# Altium project Logic_SOM.PrjPcb
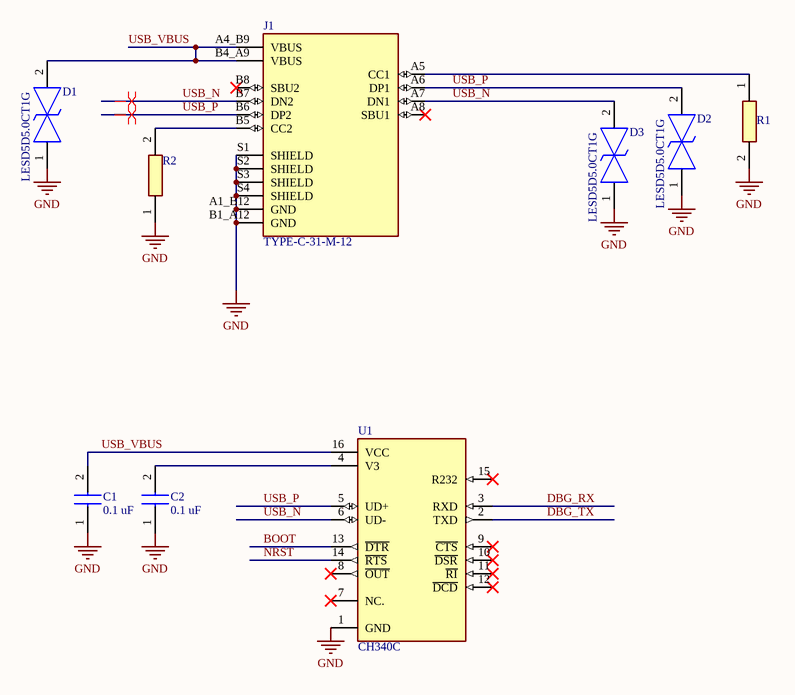
[diagram p0: programmer.SchDoc]
5 sheets, 61 parts. Net scope: global (net labels, ports and power ports of the same name join across sheets).
Board file: PCB1.PcbDoc
Sheets:
  programmer.SchDoc
  MCU.SchDoc
  PWR.SchDoc
  GSM.SchDoc
  ADC.SchDoc

## Sheet programmer.SchDoc
size A; SheetNumber: 1; SheetTotal: 5

### Parts
C1  0.1 uF  [CAP0603]
C2  0.1 uF  [CAP0603]
D1  LESD5D5.0CT1G  [LESD5D50CT1G]
D2  LESD5D5.0CT1G  [LESD5D50CT1G]
D3  LESD5D5.0CT1G  [LESD5D50CT1G]
J1  TYPE-C-31-M-12  [HRO_TYPE-C-31-M-12]
R1  CRCW0402100KFKEDHP  [RESC1005X40N]  (value not drawn)
R2  CRCW0402100KFKEDHP  [RESC1005X40N]  (value not drawn)
U1  CH340C  [SOIC127P600X180-16N]

### Nets
GND: C1.1 C2.1 D1.1 D2.1 D3.1 J1.A1_B12(GND) J1.B1_A12(GND) J1.S1(SHIELD) J1.S2(SHIELD) J1.S3(SHIELD) J1.S4(SHIELD) R1.2 R2.1 U1.1(GND)
USB_VBUS: C1.2 D1.2 J1.A4_B9(VBUS) J1.B4_A9(VBUS) U1.16(VCC)
BOOT: U1.13(~{DTR})
DBG_RX: U1.3(RXD)
DBG_TX: U1.2(TXD)
NRST: U1.14(~{RTS})
USB_N: D3.2 J1.A7(DN1) J1.B7(DN2) U1.6(UD-)
USB_P: D2.2 J1.A6(DP1) J1.B6(DP2) U1.5(UD+)
NetC2_2: C2.2 U1.4(V3)
NetJ1_A5: J1.A5(CC1) R1.1
NetJ1_B5: J1.B5(CC2) R2.2

Not connected (* = marked no-connect by the designer): J1 A8(SBU1)* B8(SBU2)*; U1 7(NC.)* 8(~{OUT})* 9(~{CTS})* 10(~{DSR})* 11(~{RI})* 12(~{DCD})* 15(R232)*

### Layout directives
differential pair: USB_N, USB_P

### Library data of the parts
C1 C2 = CC0603KRX7R9BB104: Capacitor; Manufacturer_Name: YAGEO; Datasheet Link: https://componentsearchengine.com/Datasheets/2/CC0603KRX7R9BB104.pdf; Height: 0.9mm; Manufacturer_Part_Number: CC0603KRX7R9BB104; Mouser Part Number: 603-CC603KRX7R9BB104; Mouser Price/Stock: https://www.mouser.co.uk/ProductDetail/YAGEO/CC0603KRX7R9BB104?qs=vTakOoo5QyLvVCYM2ge8LQ%3D%3D; Arrow Part Number: CC0603KRX7R9BB104; Arrow Price/Stock: https://www.arrow.com/en/products/cc0603krx7r9bb104/yageo?utm_currency=USD&region=europe
D1-D3 = LESD5D5.0CT1G: TVS Diode (Bi-directional); Manufacturer_Name: LRC; Height: 0.7mm; Manufacturer_Part_Number: LESD5D5.0CT1G
J1 = TYPE-C-31-M-12: USB Connectors 24 Receptacle 1 8.94*7.3mm RoHS; MF: HRO Electronics Co., Ltd.; SnapEDA_Link: https://www.snapeda.com/parts/TYPE-C-31-M-12/HRO+Electronics+Co.%252C+Ltd./view-part/?ref=snap; Package: Package; Value: *; MP: TYPE-C-31-M-12; Check_prices: https://www.snapeda.com/parts/TYPE-C-31-M-12/HRO+Electronics+Co.%252C+Ltd./view-part/?ref=eda
R1 R2 = CRCW0402100KFKEDHP: Resistor; Manufacturer_Name: Vishay; Datasheet Link: http://www.vishay.com/docs/20035/dcrcwe3.pdf; Height: 0.4mm; Manufacturer_Part_Number: CRCW0402100KFKEDHP; Mouser Part Number: 71-CRCW0402100KFKEDH; Mouser Price/Stock: https://www.mouser.co.uk/ProductDetail/Vishay-Dale/CRCW0402100KFKEDHP?qs=k2%2FDWSARqgGFakjlJe4Ejw%3D%3D; Arrow Part Number: CRCW0402100KFKEDHP; Arrow Price/Stock: https://www.arrow.com/en/products/crcw0402100kfkedhp/vishay?utm_currency=USD&region=nac
U1 = CH340C: USB to serial chip CH340; MF: WCH; Price: None; Availability: Not in stock; MP: CH340C; Package: None; SnapEDA_Link: https://www.snapeda.com/parts/CH340C/WCH/view-part/?ref=snap; Check_prices: https://www.snapeda.com/parts/CH340C/WCH/view-part/?ref=eda; Value: *

## Sheet MCU.SchDoc
size A3; SheetNumber: 2; SheetTotal: 5
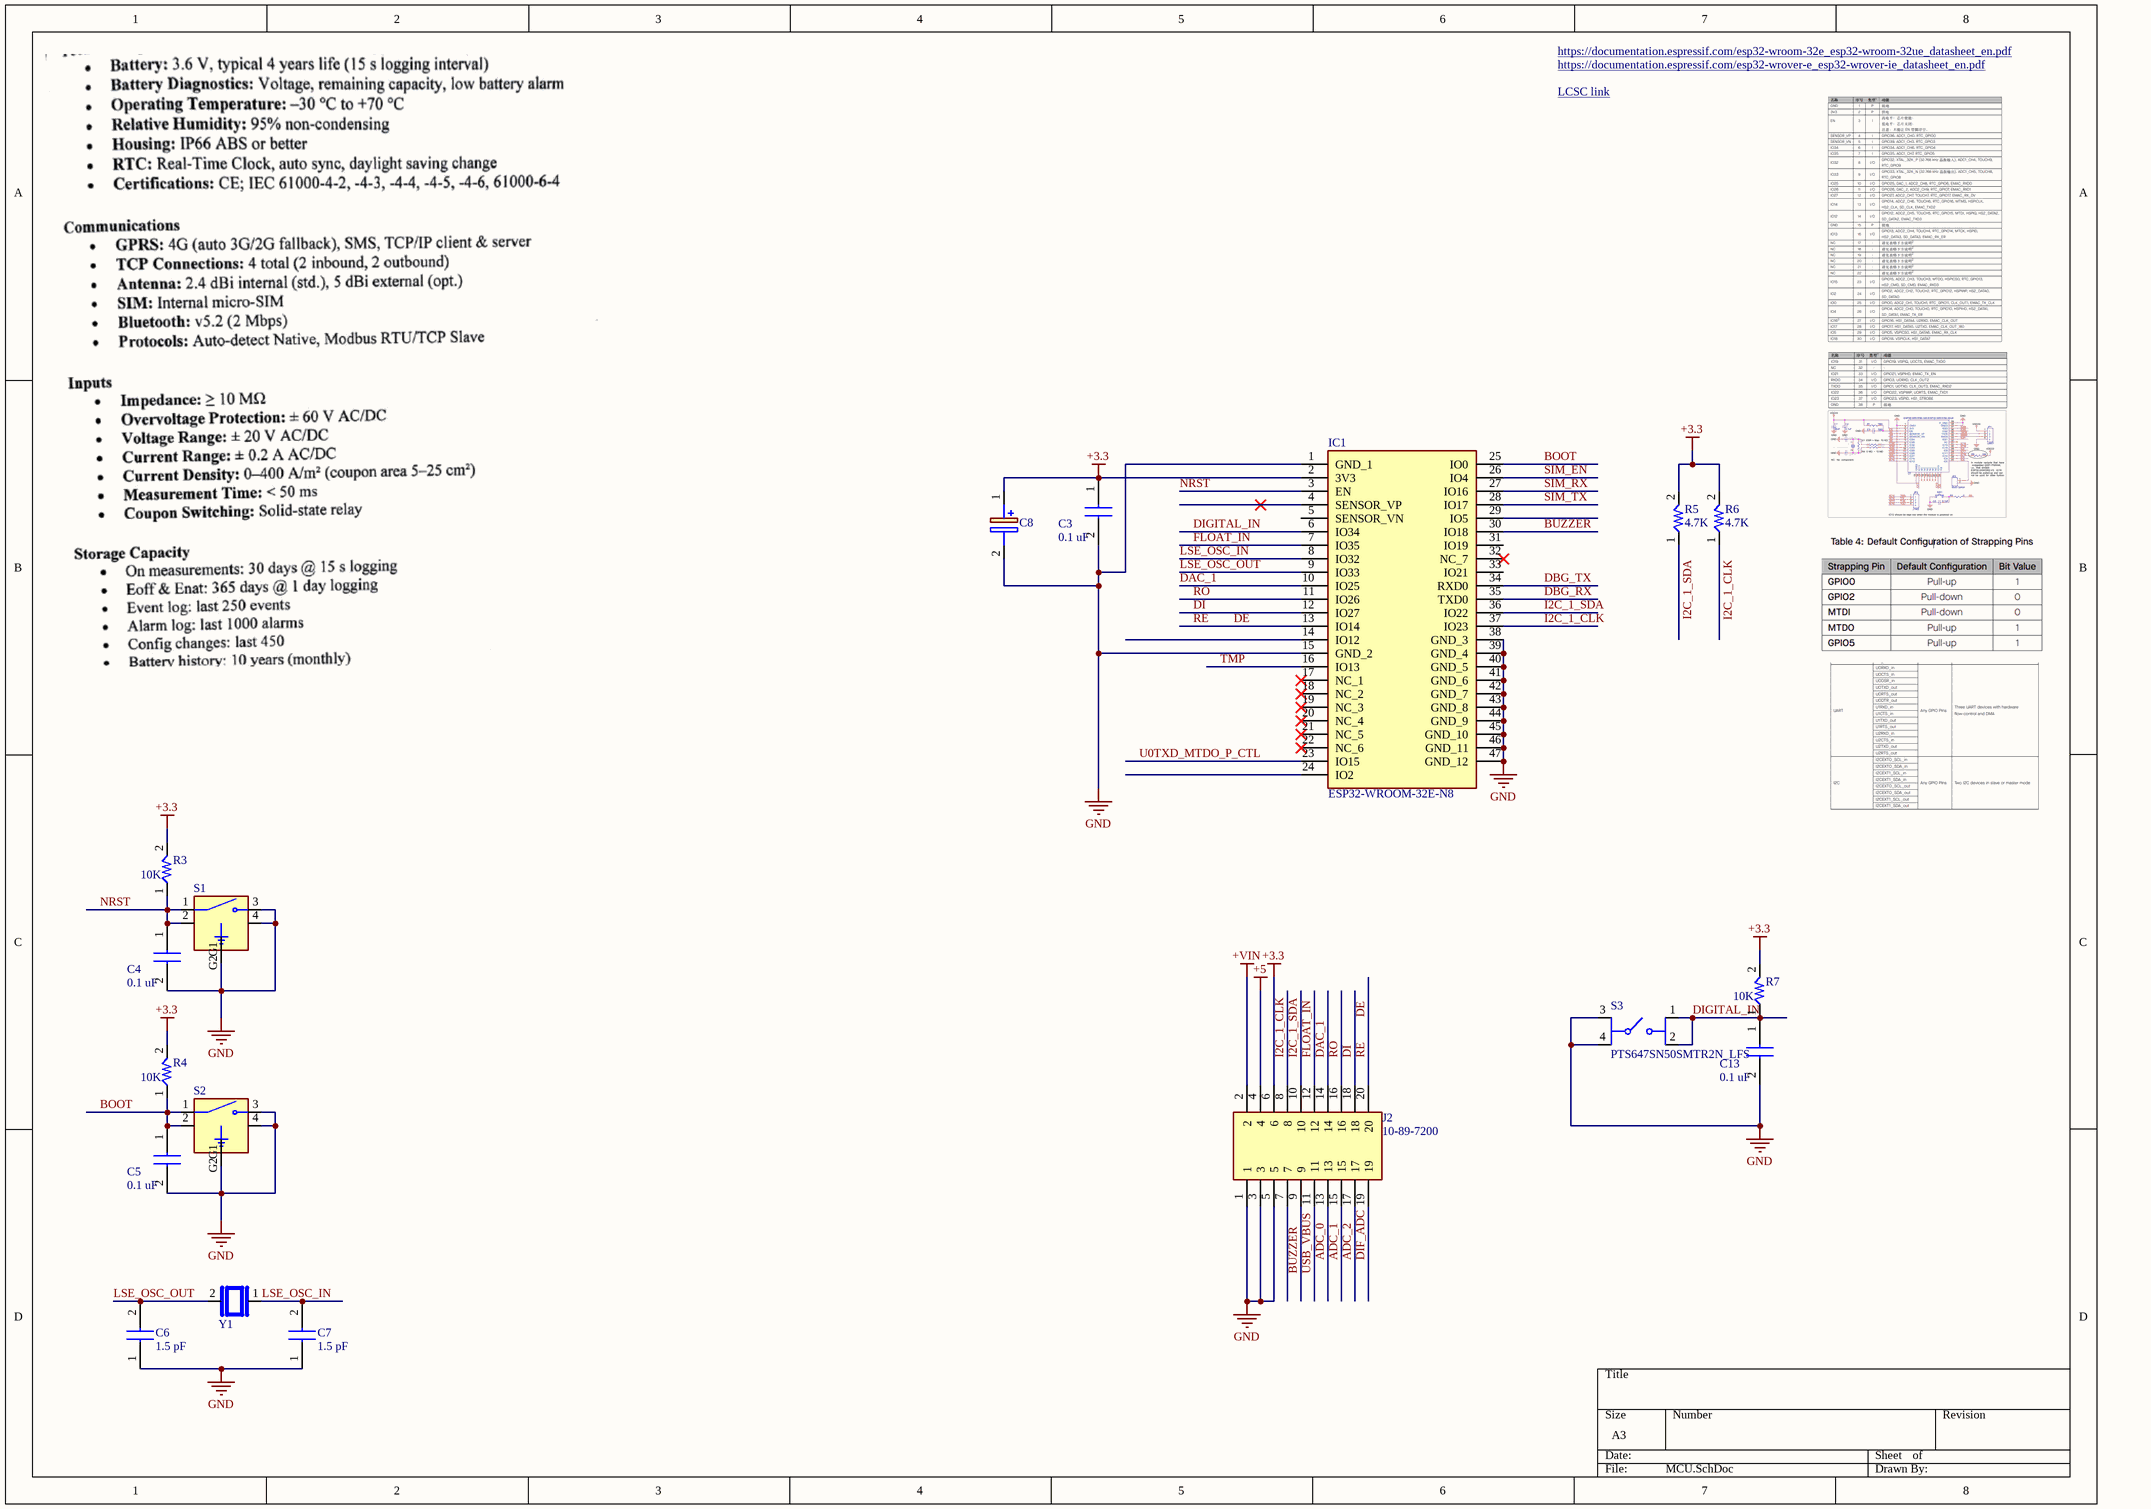
[diagram p1: MCU.SchDoc]

### Parts
C3  0.1 uF  [CAP0603]
C4  0.1 uF  [CAP0603]
C5  0.1 uF  [CAP0603]
C6  1.5 pF  [CAP0603]
C7  1.5 pF  [CAP0603]
C8  TPSD227K010R0100  [CAPPM7344X310N]  (value not drawn)
C13  0.1 uF  [CAP0603]
IC1  ESP32-WROOM-32E-N8  [ESP32WROOM32EN8]
J2  10-89-7200  [HDRV20W87P254_2X10_2553X508X864P]
R3  10K  [RES0603]
R4  10K  [RES0603]
R5  4.7K  [RES0603]
R6  4.7K  [RES0603]
R7  10K  [RES0603]
S1  PTS526_SMG15_SMTR2_LFS  [SW_PTS526_SMG15_SMTR2_LFS]  (value not drawn)
S2  PTS526_SMG15_SMTR2_LFS  [SW_PTS526_SMG15_SMTR2_LFS]  (value not drawn)
S3  PTS647SN50SMTR2N_LFS  [PTS647SK50SMTR2LFS]
Y1  CM8V-T1A-32.768KHZ-6PF-20PPM-TA-QC  [XTAL_CM8V-T1A-32.768KHZ-6PF-20PPM-TA-QC]  (value not drawn)

### Nets
+3.3: C3.1 C8.1(+) IC1.2(3V3) J2.6 R3.2 R4.2 R5.2 R6.2 R7.2
+5: J2.4
+VIN: J2.2
GND: C3.2 C4.2 C5.2 C6.1 C7.1 C8.2(-) C13.2 IC1.1(GND_1) IC1.15(GND_2) IC1.38(GND_3) IC1.39(GND_4) IC1.40(GND_5) IC1.41(GND_6) IC1.42(GND_7) IC1.43(GND_8) IC1.44(GND_9) IC1.45(GND_10) IC1.46(GND_11) IC1.47(GND_12) J2.1 J2.3 J2.5 S1.3(NO) S1.4(NO) S1.G2(GND) S2.3(NO) S2.4(NO) S2.G2(GND) S3.3(COM_1) S3.4(COM_2)
USB_VBUS: J2.11
ADC_0: J2.13
ADC_1: J2.15
ADC_2: J2.17
BOOT: C5.1 IC1.25(IO0) R4.1 S2.1(COM) S2.2(COM)
BUZZER: IC1.30(IO18) J2.9
DAC_1: IC1.10(IO25) J2.14
DBG_RX: IC1.35(TXD0)
DBG_TX: IC1.34(RXD0)
DE: IC1.13(IO14) J2.20  [also labelled RE]
DI: IC1.12(IO27) J2.18
DIF_ADC: J2.19
DIGITAL_IN: C13.1 IC1.6(IO34) R7.1 S3.1(NO_1) S3.2(NO_2)
FLOAT_IN: IC1.7(IO35) J2.12
I2C_1_CLK: IC1.37(IO23) J2.8 R6.1
I2C_1_SDA: IC1.36(IO22) J2.10 R5.1
LSE_OSC_IN: C7.2 IC1.8(IO32) Y1.1
LSE_OSC_OUT: C6.2 IC1.9(IO33) Y1.2
NRST: C4.1 IC1.3(EN) R3.1 S1.1(COM) S1.2(COM)
RO: IC1.11(IO26) J2.16
SIM_EN: IC1.26(IO4)
SIM_RX: IC1.27(IO16)
SIM_TX: IC1.28(IO17)
TMP: IC1.16(IO13)
U0TXD_MTDO_P_CTL: IC1.23(IO15)

Not connected (* = marked no-connect by the designer): IC1 4(SENSOR_VP)* 5(SENSOR_VN) 14(IO12) 17(NC_1)* 18(NC_2)* 19(NC_3)* 20(NC_4)* 21(NC_5)* 22(NC_6)* 24(IO2) 29(IO5) 31(IO19) 32(NC_7)* 33(IO21); J2 7; S1 G1(GND); S2 G1(GND)

### Notes on the sheet
- https://documentation.espressif.com/esp32-wroom-32e_esp32-wroom-32ue_datasheet_en.pdf
- https://documentation.espressif.com/esp32-wrover-e_esp32-wrover-ie_datasheet_en.pdf
- LCSC link <https://www.lcsc.com/product-detail/C701342.html?s_z=n_q_t_esp32&spm=wm.fly.bg.3.xh___wm.ssy.tc.0.tz&lcsc_vid=EVJdVVYDQlEPAgBWRwALVwJWFlQKUQJQQwdXUVRSQFIxVlNeRlBXXlJfTlRXVDsOAxUeFF5JWBYZEEoKFBINSQcJGk4dAgUUFAk%3D>

### Library data of the parts
C3-C7 C13 = CC0603KRX7R9BB104: Capacitor; Manufacturer_Name: YAGEO; Datasheet Link: https://componentsearchengine.com/Datasheets/2/CC0603KRX7R9BB104.pdf; Height: 0.9mm; Manufacturer_Part_Number: CC0603KRX7R9BB104; Mouser Part Number: 603-CC603KRX7R9BB104; Mouser Price/Stock: https://www.mouser.co.uk/ProductDetail/YAGEO/CC0603KRX7R9BB104?qs=vTakOoo5QyLvVCYM2ge8LQ%3D%3D; Arrow Part Number: CC0603KRX7R9BB104; Arrow Price/Stock: https://www.arrow.com/en/products/cc0603krx7r9bb104/yageo?utm_currency=USD&region=europe
C8 = TPSD227K010R0100: Capacitor Polarised; Manufacturer_Name: Kyocera AVX; Datasheet Link: https://componentsearchengine.com/Datasheets/2/TPSD227K010R0100.pdf; Height: 3.1mm; Manufacturer_Part_Number: TPSD227K010R0100; Mouser Part Number: 581-TPSD227K010R0100; Mouser Price/Stock: https://www.mouser.co.uk/ProductDetail/KYOCERA-AVX/TPSD227K010R0100?qs=VG9BpzG3P7aRGNUSeWjfzQ%3D%3D; Arrow Part Number: TPSD227K010R0100; Arrow Price/Stock: https://www.arrow.com/en/products/tpsd227k010r0100/avx
IC1 = ESP32-WROOM-32E-N8: Integrated Circuit; Manufacturer_Name: Espressif Systems; Datasheet Link: https://www.google.com/url?sa=t&rct=j&q=&esrc=s&source=web&cd=&ved=2ahUKEwjLw4ysybv2AhXFzIUKHZUbB64QFnoECCwQAQ&url=https%3A%2F%2Fwww.espressif.com%2Fsites%2Fdefault%2Ffiles%2Fdocumentation%2Fesp32-wroom-32e_esp32-wroom-32ue_datasheet_en.pdf&usg=AOvVaw1xSL; Height: 3.25mm; Manufacturer_Part_Number: ESP32-WROOM-32E-N8; Mouser Part Number: 356-ESP32WRM32E164PH; Mouser Price/Stock: https://www.mouser.co.uk/ProductDetail/Espressif-Systems/ESP32-WROOM-32E-N8?qs=Li%252BoUPsLEnsLnZW%252BGLgUhw%3D%3D
J2 = 10-89-7200: Connector; Manufacturer_Name: Molex; Datasheet Link: https://www.molex.com/content/dam/molex/molex-dot-com/products/automated/en-us/salesdrawingpdf/702/70280/010897200_sd.pdf?inline; Height: 8.64mm; Manufacturer_Part_Number: 10-89-7200; Mouser Part Number: 538-10-89-7200; Mouser Price/Stock: https://www.mouser.co.uk/ProductDetail/Molex/10-89-7200?qs=oWQp3ZoCHH25CPUgqQXm8A%3D%3D
R3-R7 = RES: Resistor; Manufacturer_Name: UNI-ROYAL(Uniroyal Elec); Manufacturer_Part_Number: 0603WAF1001T5E; Datasheet Link: https://datasheet.lcsc.com/szlcsc/Uniroyal-Elec-0603WAF1001T5E_C21190.pdf; Height: 0.55mm
S1 S2 = PTS526_SMG15_SMTR2_LFS: Tactile Switch SPST-NO Top Actuated Surface Mount; MP: PTS526 SMG15 SMTR2 LFS; MF: C&K; Availability: In Stock; SnapEDA_Link: https://www.snapeda.com/parts/PTS526%20SMG15%20SMTR2%20LFS/C%2526K/view-part/?ref=snap; Value: *; Package: None; Price: None; Purchase-URL: https://pricing.snapeda.com/search/part/PTS526 SMG15 SMTR2 LFS/?ref=eda; Check_prices: https://www.snapeda.com/parts/PTS526%20SMG15%20SMTR2%20LFS/C%2526K/view-part/?ref=eda
S3 = PTS647SN50SMTR2N_LFS: Switch (4-Pin Push); Manufacturer_Name: LITTELFUSE; Manufacturer_Part_Number: PTS647SN50SMTR2N LFS; Datasheet Link: https://www.ckswitches.com/media/2567/pts647.pdf
Y1 = CM8V-T1A-32.768KHZ-6PF-20PPM-TA-QC: Tuning Fork Crystal 32.768kHz in SMD 1.2 x 2.0mm package; MF: Micro Crystal; SnapEDA_Link: https://www.snapeda.com/parts/CM8V-T1A-32.768kHz-6pF-20PPM-TA-QC/Micro+Crystal/view-part/?ref=snap; Package: SMD-2 Micro Crystal; Value: *; MP: CM8V-T1A-32.768kHz-6pF-20PPM-TA-QC; Check_prices: https://www.snapeda.com/parts/CM8V-T1A-32.768kHz-6pF-20PPM-TA-QC/Micro+Crystal/view-part/?ref=eda

## Sheet PWR.SchDoc
size A; SheetNumber: 3; SheetTotal: 5
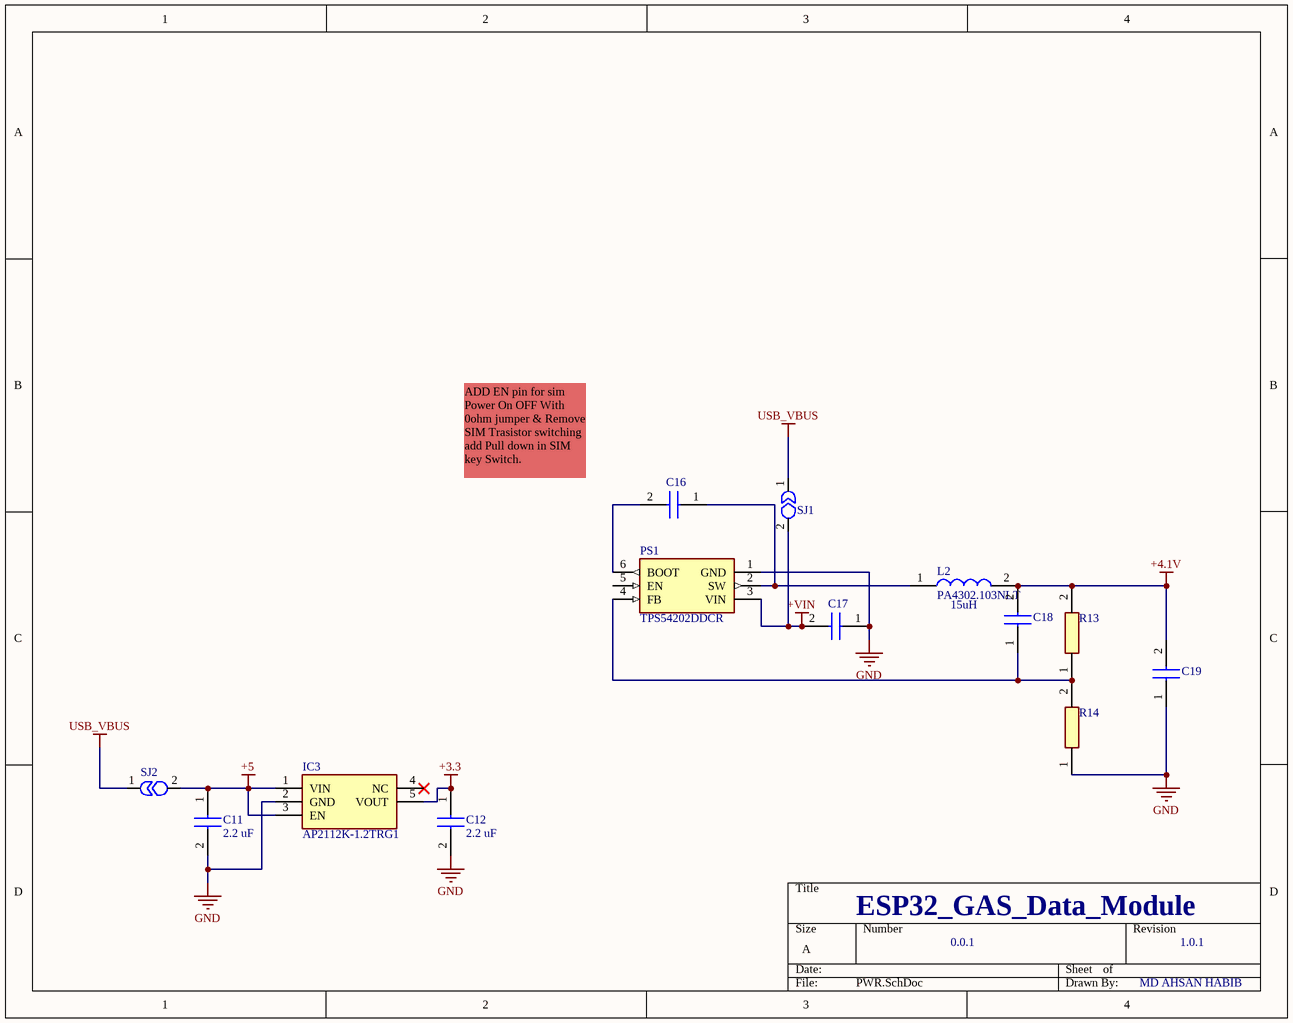
[diagram p2: PWR.SchDoc]

### Parts
C11  2.2 uF  [CAP0603]
C12  2.2 uF  [CAP0603]
C16  C0805C104M5RAC-TU  [CAPC2012X88N]  (value not drawn)
C17  C5750X5R1H106K230KA  [CAP0603]  (value not drawn)
C18  GRM0335C1E560JA01D  [CAP0603]  (value not drawn)
C19  GRM32ER61C476KE15L  [CAPC3225X270N]  (value not drawn)
IC3  AP2112K-1.2TRG1  [SOT95P285X140-5N]
L2  PA4302.103NLT  [PA4302103NLT]
PS1  TPS54202DDCR  [SOT95P280X110-6N]
R13  CRCW0402100KFKEDHP  [RES0603]  (value not drawn)
R14  CRCW040216K9FKEDHP  [RES0603]  (value not drawn)
SJ1  SOLDER_JUMPER_1206  [JUMP_SOLDER_JUMPER_1206]  (value not drawn)
SJ2  SOLDER_JUMPER_1206  [JUMP_SOLDER_JUMPER_1206]  (value not drawn)

### Nets
+3.3: C12.1 IC3.5(VOUT)
+4.1V: C18.2 C19.2 L2.2 R13.2
+5: C11.1 IC3.1(VIN) IC3.3(EN) SJ2.2
+VIN: C17.2 PS1.3(VIN) SJ1.2
GND: C11.2 C12.2 C17.1 C19.1 IC3.2(GND) PS1.1(GND) R14.1
USB_VBUS: SJ1.1 SJ2.1
NetC16_1: C16.1 L2.1 PS1.2(SW)
NetC16_2: C16.2 PS1.6(BOOT)
NetC18_1: C18.1 PS1.4(FB) R13.1 R14.2

Not connected (* = marked no-connect by the designer): IC3 4(NC)*; PS1 5(EN)

### Notes on the sheet
- ADD EN pin for sim Power On OFF With 0ohm jumper & Remove SIM Trasistor switching add Pull down in SIM key Switch.
- (near L2) 15uH
- ESP32_GAS_Data_Module
- 0.0.1
- 1.0.1
- MD AHSAN HABIB

### Library data of the parts
C11 C12 = CC0603KRX7R9BB104: Capacitor; Manufacturer_Name: YAGEO; Datasheet Link: https://componentsearchengine.com/Datasheets/2/CC0603KRX7R9BB104.pdf; Height: 0.9mm; Manufacturer_Part_Number: CC0603KRX7R9BB104; Mouser Part Number: 603-CC603KRX7R9BB104; Mouser Price/Stock: https://www.mouser.co.uk/ProductDetail/YAGEO/CC0603KRX7R9BB104?qs=vTakOoo5QyLvVCYM2ge8LQ%3D%3D; Arrow Part Number: CC0603KRX7R9BB104; Arrow Price/Stock: https://www.arrow.com/en/products/cc0603krx7r9bb104/yageo?utm_currency=USD&region=europe
C16 = C0805C104M5RAC-TU: Capacitor; Manufacturer_Name: Yageo Group; Datasheet Link: https://connect.kemet.com:7667/gateway/IntelliData-ComponentDocumentation/1.0/download/specsheet/C0805C104M5RACTU; Height: 0.88mm; Manufacturer_Part_Number: C0805C104M5RAC-TU; Arrow Part Number: C0805C104M5RAC-TU; Arrow Price/Stock: https://www.arrow.com/en/products/c0805c104m5ractu/kemet-corporation?region=nac
C17 = C5750X5R1H106K230KA: Capacitor; Manufacturer_Name: TDK; Datasheet Link: https://product.tdk.com/system/files/dam/doc/product/capacitor/ceramic/mlcc/catalog/mlcc_commercial_general_en.pdf; Height: 2.5mm; Manufacturer_Part_Number: C5750X5R1H106K230KA; Mouser Part Number: 810-C5750X5R1H106K; Mouser Price/Stock: https://www.mouser.co.uk/ProductDetail/TDK/C5750X5R1H106K230KA?qs=NRhsANhppD8lVYAvl0MZ3g%3D%3D; Arrow Part Number: C5750X5R1H106K230KA; Arrow Price/Stock: https://www.arrow.com/en/products/c5750x5r1h106k230ka/tdk?region=nac
C18 = GRM0335C1E560JA01D: Capacitor; Manufacturer_Name: Murata Electronics; Height: 0.33mm; Manufacturer_Part_Number: GRM0335C1E560JA01D; Mouser Part Number: 81-GRM0335C1E560JA1D; Mouser Price/Stock: https://www.mouser.com/Search/Refine.aspx?Keyword=81-GRM0335C1E560JA1D; Arrow Part Number: GRM0335C1E560JA01D; Arrow Price/Stock: https://www.arrow.com/en/products/grm0335c1e560ja01d/murata-manufacturing
C19 = GRM32ER61C476KE15L: Capacitor; Manufacturer_Name: Murata Electronics; Datasheet Link: https://search.murata.co.jp/Ceramy/image/img/A01X/G101/ENG/GRM32ER61C476KE15-01A.pdf; Height: 2.7mm; Manufacturer_Part_Number: GRM32ER61C476KE15L; Mouser Part Number: 81-GRM32ER61C476KE5L; Mouser Price/Stock: https://www.mouser.co.uk/ProductDetail/Murata-Electronics/GRM32ER61C476KE15L?qs=%252B%2F7tQhzlcy7Im%2F1Gh2YSGQ%3D%3D; Arrow Part Number: GRM32ER61C476KE15L; Arrow Price/Stock: https://www.arrow.com/en/products/grm32er61c476ke15l/murata-manufacturing?utm_currency=USD&region=europe
IC3 = AP2112K-1.2TRG1: Integrated Circuit; Manufacturer_Name: Diodes Incorporated; Datasheet Link: https://www.diodes.com/assets/Datasheets/AP2112.pdf; Height: 1.4mm; Manufacturer_Part_Number: AP2112K-1.2TRG1; Mouser Part Number: 621-AP2112K-1.2TRG1; Mouser Price/Stock: https://www.mouser.co.uk/ProductDetail/Diodes-Incorporated/AP2112K-1.2TRG1?qs=dZoB6MK9LKOx%252Blz%2FhgH2SA%3D%3D; Arrow Part Number: AP2112K-1.2TRG1; Arrow Price/Stock: https://www.arrow.com/en/products/ap2112k-1.2trg1/diodes-incorporated.html?utm_currency=USD&region=nac
L2 = PA4302.103NLT: Inductor; Manufacturer_Name: Yageo Group; Datasheet Link: https://www.mouser.com/datasheet/2/336/-559356.pdf; Height: 5.6mm; Manufacturer_Part_Number: PA4302.103NLT; Mouser Part Number: 673-PA4302.103NLT; Mouser Price/Stock: https://www.mouser.co.uk/ProductDetail/Pulse-Electronics/PA4302.103NLT?qs=ZU1dyKYMvyPXoPwo6qMOJg%3D%3D; Arrow Part Number: PA4302.103NLT; Arrow Price/Stock: https://www.arrow.com/en/products/pa4302.103nlt/pulse-electronics-corporation?region=nac
PS1 = TPS54202DDCR: Power Supply; Manufacturer_Name: Texas Instruments; Datasheet Link: http://www.ti.com/lit/gpn/tps54202; Height: 1.1mm; Manufacturer_Part_Number: TPS54202DDCR; Mouser Part Number: 595-TPS54202DDCR; Mouser Price/Stock: https://www.mouser.co.uk/ProductDetail/Texas-Instruments/TPS54202DDCR?qs=uP22XH7NdCsJtN%2Fq54jCtQ%3D%3D; Arrow Part Number: TPS54202DDCR; Arrow Price/Stock: https://www.arrow.com/en/products/tps54202ddcr/texas-instruments?utm_currency=USD&region=nac
R13 = CRCW0402100KFKEDHP: Resistor; Manufacturer_Name: Vishay; Datasheet Link: http://www.vishay.com/docs/20035/dcrcwe3.pdf; Height: 0.4mm; Manufacturer_Part_Number: CRCW0402100KFKEDHP; Mouser Part Number: 71-CRCW0402100KFKEDH; Mouser Price/Stock: https://www.mouser.co.uk/ProductDetail/Vishay-Dale/CRCW0402100KFKEDHP?qs=k2%2FDWSARqgGFakjlJe4Ejw%3D%3D; Arrow Part Number: CRCW0402100KFKEDHP; Arrow Price/Stock: https://www.arrow.com/en/products/crcw0402100kfkedhp/vishay?utm_currency=USD&region=nac
R14 = CRCW040216K9FKEDHP: Resistor; Manufacturer_Name: Vishay; Datasheet Link: http://www.vishay.com/docs/20035/dcrcwe3.pdf; Height: 0.4mm; Manufacturer_Part_Number: CRCW040216K9FKEDHP; Mouser Part Number: 71-CRCW040216K9FKEDH; Mouser Price/Stock: https://www.mouser.com/Search/Refine.aspx?Keyword=71-CRCW040216K9FKEDH
SJ1 SJ2 = SOLDER_JUMPER_1206: Package: None; Price: None; Value: *; MP: SOLDER_JUMPER_1206; Availability: Unavailable

## Sheet GSM.SchDoc
size A; SheetNumber: 4; SheetTotal: 5
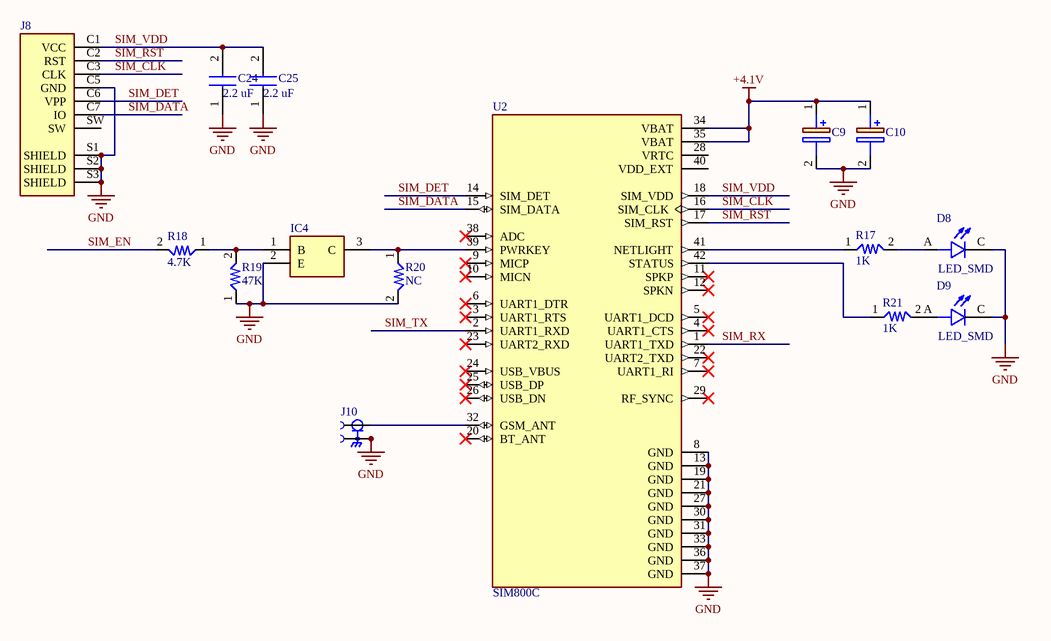
[diagram p3: GSM.SchDoc]

### Parts
C9  TPSD227K010R0100  [CAPPM7344X310N]  (value not drawn)
C10  TPSD227K010R0100  [CAPPM7344X310N]  (value not drawn)
C24  2.2 uF  [CAP0603]
C25  2.2 uF  [CAP0603]
D8  LED_SMD  [LEDSC125X200X90-2N]
D9  LED_SMD  [LEDSC125X200X90-2N]
IC4  MMBT2222ALT1G  [SOT96P237X111-3N]  (value not drawn)
J8  SIM8060-6-1-14-00-A  [GCT_SIM8060-6-1-14-00-A]  (value not drawn)
J10  CONUFL001-SMD  [LINX_CONUFL001-SMD]  (value not drawn)
R17  1K  [RES0603]
R18  4.7K  [RES0603]
R19  47K  [RES0603]
R20  NC  [RES0603]
R21  1K  [RES0603]
U2  SIM800C  [LCC110P1570X1760X250-42N]

### Nets
+4.1V: C9.1(+) C10.1(+) U2.34(VBAT) U2.35(VBAT)
GND: C9.2(-) C10.2(-) C24.1 C25.1 D8.C D9.C IC4.2(E) J8.C5(GND) J8.S1(SHIELD) J8.S2(SHIELD) J8.S3(SHIELD) J10.2 J10.3 R19.1 R20.2 U2.8(GND) U2.13(GND) U2.19(GND) U2.21(GND) U2.27(GND) U2.30(GND) U2.31(GND) U2.33(GND) U2.36(GND) U2.37(GND)
SIM_CLK: J8.C3(CLK) U2.16(SIM_CLK)
SIM_DATA: J8.C7(IO) U2.15(SIM_DATA)
SIM_DET: J8.C6(VPP) U2.14(SIM_DET)
SIM_EN: R18.2
SIM_RST: J8.C2(RST) U2.17(SIM_RST)
SIM_RX: U2.1(UART1_TXD)
SIM_TX: U2.2(UART1_RXD)
SIM_VDD: C24.2 C25.2 J8.C1(VCC) U2.18(SIM_VDD)
NetD8_A: D8.A R17.2
NetD9_A: D9.A R21.2
NetIC4_1: IC4.1(B) R18.1 R19.2
NetIC4_3: IC4.3(C) R20.1 U2.39(PWRKEY)
NetJ10_1: J10.1 U2.32(GSM_ANT)
NetR17_1: R17.1 U2.41(NETLIGHT)
NetR21_1: R21.1 U2.42(STATUS)

Not connected (* = marked no-connect by the designer): J8 SW; U2 3(UART1_RTS)* 4(UART1_CTS)* 5(UART1_DCD)* 6(UART1_DTR)* 7(UART1_RI)* 9(MICP)* 10(MICN)* 11(SPKP)* 12(SPKN)* 20(BT_ANT)* 22(UART2_TXD)* 23(UART2_RXD)* 24(USB_VBUS)* 25(USB_DP)* 26(USB_DN)* 28(VRTC) 29(RF_SYNC)* 38(ADC)* 40(VDD_EXT)

### Library data of the parts
C9 C10 = TPSD227K010R0100: as C8 on sheet MCU; Datasheet Link: https://componentsearchengine.com/Datasheets/2/TPSD227K010R0100.pdf; Height: 3.1mm; Manufacturer_Part_Number: TPSD227K010R0100; Mouser Part Number: 581-TPSD227K010R0100; Mouser Price/Stock: https://www.mouser.co.uk/ProductDetail/KYOCERA-AVX/TPSD227K010R0100?qs=VG9BpzG3P7aRGNUSeWjfzQ%3D%3D; Arrow Part Number: TPSD227K010R0100; Arrow Price/Stock: https://www.arrow.com/en/products/tpsd227k010r0100/avx
C24 C25 = CC0603KRX7R9BB104: Capacitor; Manufacturer_Name: YAGEO; Datasheet Link: https://componentsearchengine.com/Datasheets/2/CC0603KRX7R9BB104.pdf; Height: 0.9mm; Manufacturer_Part_Number: CC0603KRX7R9BB104; Mouser Part Number: 603-CC603KRX7R9BB104; Mouser Price/Stock: https://www.mouser.co.uk/ProductDetail/YAGEO/CC0603KRX7R9BB104?qs=vTakOoo5QyLvVCYM2ge8LQ%3D%3D; Arrow Part Number: CC0603KRX7R9BB104; Arrow Price/Stock: https://www.arrow.com/en/products/cc0603krx7r9bb104/yageo?utm_currency=USD&region=europe
D8 D9 = 5990110007F: Red 633nm LED Indication - Discrete 2.1V 0805 (2012 Metric); MF: Dialight; MP: 599-0110-007F; Check_prices: https://www.snapeda.com/parts/599-0110-007F/Dialight/view-part/?ref=eda; Value: *; Purchase-URL: https://pricing.snapeda.com/search/part/599-0110-007F/?ref=eda; Price: None; SnapEDA_Link: https://www.snapeda.com/parts/599-0110-007F/Dialight/view-part/?ref=snap; Availability: In Stock; Package: 0805 Dialight
IC4 = MMBT2222ALT1G: Integrated Circuit; Manufacturer_Name: Rochester Electronics; Datasheet Link: https://www.onsemi.com/pdf/datasheet/mmbt2222lt1-d.pdf; Height: 1.11mm; Manufacturer_Part_Number: MMBT2222ALT1G
J8 = SIM8060-6-1-14-00-A: 6 Position Card Connector NANO SIM Surface Mount, Right Angle Gold; MF: Global Connector Technology; Package: Package Analog Devices; Value: *; Price: None; MP: SIM8060-6-1-14-00-A; SnapEDA_Link: https://www.snapeda.com/parts/SIM8060-6-1-14-00-A/Global%20Connector%20Technology/view-part/3075869/?ref=snap; Availability: Unavailable
J10 = CONUFL001-SMD: MF: Linx; Availability: In Stock; Price: None; SnapEDA_Link: https://www.snapeda.com/parts/CONUFL001-SMD/Linx/view-part/5842340/?ref=snap; Value: *; Check_prices: https://www.snapeda.com/parts/CONUFL001-SMD/Linx/view-part/5842340/?ref=eda; MP: CONUFL001-SMD; Package: None
R17-R21 = RES: as R3 on sheet MCU; Datasheet Link: https://datasheet.lcsc.com/szlcsc/Uniroyal-Elec-0603WAF1001T5E_C21190.pdf; Height: 0.55mm
U2 = SIM800C: Module: GSM/Bluetooth; GPRS; 2G; 1800MHz, 900MHz; 85.6kbps; SMD; MF: Simcom; Check_prices: https://www.snapeda.com/parts/SIM800C/SIMcom+Wireless+solutions+Co.%252CLtd/view-part/?ref=eda; Value: *; Availability: In Stock; MP: SIM800C; Price: None; Package: None; SnapEDA_Link: https://www.snapeda.com/parts/SIM800C/SIMcom+Wireless+solutions+Co.%252CLtd/view-part/?ref=snap

## Sheet ADC.SchDoc
size A; SheetNumber: 5; SheetTotal: 5
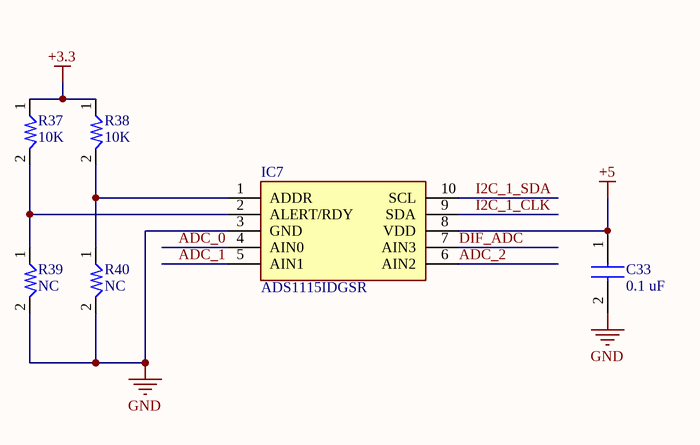
[diagram p4: ADC.SchDoc]

### Parts
C33  0.1 uF  [CAP0603]
IC7  ADS1115IDGSR  [SOP50P490X110-10N]
R37  10K  [RES0603]
R38  10K  [RES0603]
R39  NC  [RES0603]
R40  NC  [RES0603]

### Nets
+3.3: R37.1 R38.1
+5: C33.1 IC7.8(VDD)
GND: C33.2 IC7.3(GND) R39.2 R40.2
ADC_0: IC7.4(AIN0)
ADC_1: IC7.5(AIN1)
ADC_2: IC7.6(AIN2)
DIF_ADC: IC7.7(AIN3)
I2C_1_CLK: IC7.9(SDA)
I2C_1_SDA: IC7.10(SCL)
NetIC7_1: IC7.1(ADDR) R38.2 R40.1
NetIC7_2: IC7.2(ALERT/RDY) R37.2 R39.1

### Library data of the parts
C33 = CC0603KRX7R9BB104: Capacitor; Manufacturer_Name: YAGEO; Datasheet Link: https://componentsearchengine.com/Datasheets/2/CC0603KRX7R9BB104.pdf; Height: 0.9mm; Manufacturer_Part_Number: CC0603KRX7R9BB104; Mouser Part Number: 603-CC603KRX7R9BB104; Mouser Price/Stock: https://www.mouser.co.uk/ProductDetail/YAGEO/CC0603KRX7R9BB104?qs=vTakOoo5QyLvVCYM2ge8LQ%3D%3D; Arrow Part Number: CC0603KRX7R9BB104; Arrow Price/Stock: https://www.arrow.com/en/products/cc0603krx7r9bb104/yageo?utm_currency=USD&region=europe
IC7 = ADS1115IDGSR: Integrated Circuit; Manufacturer_Name: Texas Instruments; Datasheet Link: http://www.ti.com/lit/gpn/ADS1115; Height: 1.1mm; Manufacturer_Part_Number: ADS1115IDGSR; Mouser Part Number: 595-ADS1115IDGSR; Mouser Price/Stock: https://www.mouser.co.uk/ProductDetail/Texas-Instruments/ADS1115IDGSR?qs=IK5e5L0zOXjKCJoVMhYO%2FQ%3D%3D; Arrow Part Number: ADS1115IDGSR; Arrow Price/Stock: https://www.arrow.com/en/products/ads1115idgsr/texas-instruments.html?utm_currency=USD&region=nac
R37-R40 = RES: as R3 on sheet MCU; Datasheet Link: https://datasheet.lcsc.com/szlcsc/Uniroyal-Elec-0603WAF1001T5E_C21190.pdf; Height: 0.55mm

## Nets that join several sheets
+3.3: MCU (9 pins), PWR (C12.1 IC3.5), ADC (R37.1 R38.1)
+4.1V: PWR (C18.2 C19.2 L2.2 R13.2), GSM (C9.1 C10.1 U2.34 U2.35)
+5: MCU (J2.4), PWR (C11.1 IC3.1 IC3.3 SJ2.2), ADC (C33.1 IC7.8)
+VIN: MCU (J2.2), PWR (C17.2 PS1.3 SJ1.2)
GND: programmer (14 pins), MCU (30 pins), PWR (7 pins), GSM (25 pins), ADC (C33.2 IC7.3 R39.2 R40.2)
USB_VBUS: programmer (5 pins), MCU (J2.11), PWR (SJ1.1 SJ2.1)
ADC_0: MCU (J2.13), ADC (IC7.4)
ADC_1: MCU (J2.15), ADC (IC7.5)
ADC_2: MCU (J2.17), ADC (IC7.6)
BOOT: programmer (U1.13), MCU (5 pins)
DBG_RX: programmer (U1.3), MCU (IC1.35)
DBG_TX: programmer (U1.2), MCU (IC1.34)
DIF_ADC: MCU (J2.19), ADC (IC7.7)
I2C_1_CLK: MCU (IC1.37 J2.8 R6.1), ADC (IC7.9)
I2C_1_SDA: MCU (IC1.36 J2.10 R5.1), ADC (IC7.10)
NRST: programmer (U1.14), MCU (5 pins)
SIM_EN: MCU (IC1.26), GSM (R18.2)
SIM_RX: MCU (IC1.27), GSM (U2.1)
SIM_TX: MCU (IC1.28), GSM (U2.2)